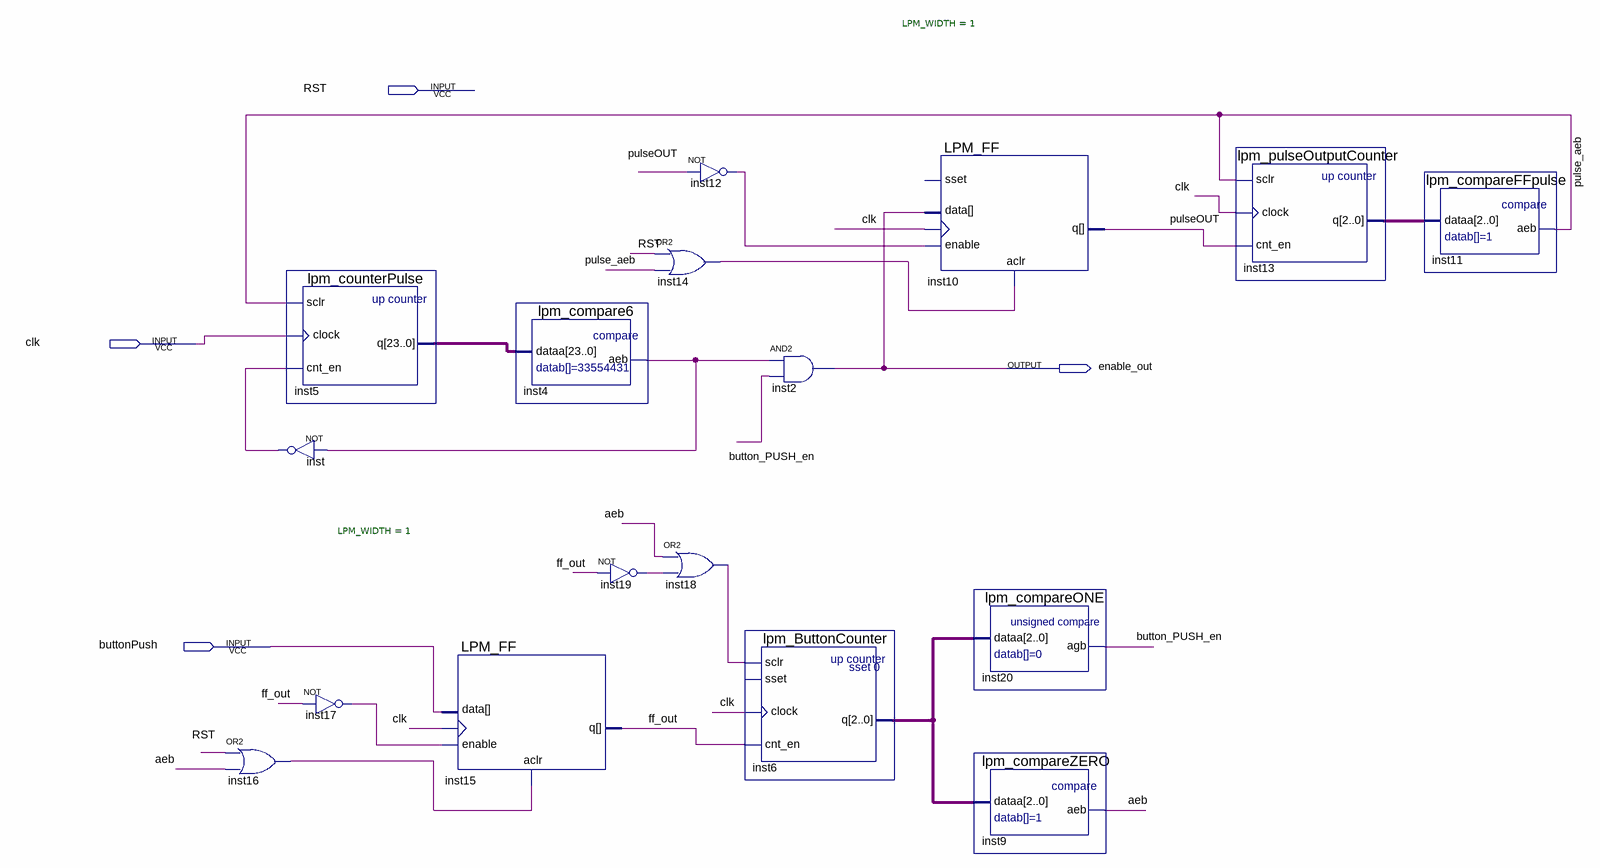
[diagram p0: schematic sheet]
// Quartus schematic g54_pulseGen.bdf as structural Verilog: 17 symbols, 4 pins
module g54_pulseGen (
  input  RST,
  input  clk,
  input  buttonPush,
  output enable_out
);

  wire aeb, button_PUSH_en, ff_out, inst4_aeb, inst12_out, inst14_out, inst16_out, inst17_out, inst18_out,
       inst19_out, inst_out, pulse_aeb, pulseOUT;
  wire [2:0] inst6_q, inst13_q;
  wire [23:0] inst5_q;

  or inst16 (inst16_out, RST, aeb);
  lpm_counterPulse inst5 (.sclr(pulse_aeb), .clock(clk), .cnt_en(inst_out), .q(inst5_q));
  not inst (inst_out, inst4_aeb);
  not inst17 (inst17_out, ff_out);
  LPM_FF #(.LPM_WIDTH(1)) inst15 (.enable(inst17_out), .clock(clk), .aclr(inst16_out), .data(buttonPush), .q(ff_out));
  lpm_compare6 inst4 (.dataa(inst5_q), .aeb(inst4_aeb));
  not inst19 (inst19_out, ff_out);
  or inst14 (inst14_out, RST, pulse_aeb);
  or inst18 (inst18_out, aeb, inst19_out);
  not inst12 (inst12_out, pulseOUT);
  and inst2 (enable_out, inst4_aeb, button_PUSH_en);
  lpm_ButtonCounter inst6 (.sclr(inst18_out), .clock(clk), .cnt_en(ff_out), .q(inst6_q));  // open: sset
  LPM_FF #(.LPM_WIDTH(1)) inst10 (
    .enable(inst12_out), .clock(clk), .aclr(inst14_out), .data(enable_out), .q(pulseOUT));  // open: sset
  lpm_compareONE inst20 (.dataa(inst6_q), .agb(button_PUSH_en));
  lpm_compareZERO inst9 (.dataa(inst6_q), .aeb(aeb));
  lpm_pulseOutputCounter inst13 (.sclr(pulse_aeb), .clock(clk), .cnt_en(pulseOUT), .q(inst13_q));
  lpm_compareFFpulse inst11 (.dataa(inst13_q), .aeb(pulse_aeb));
endmodule
